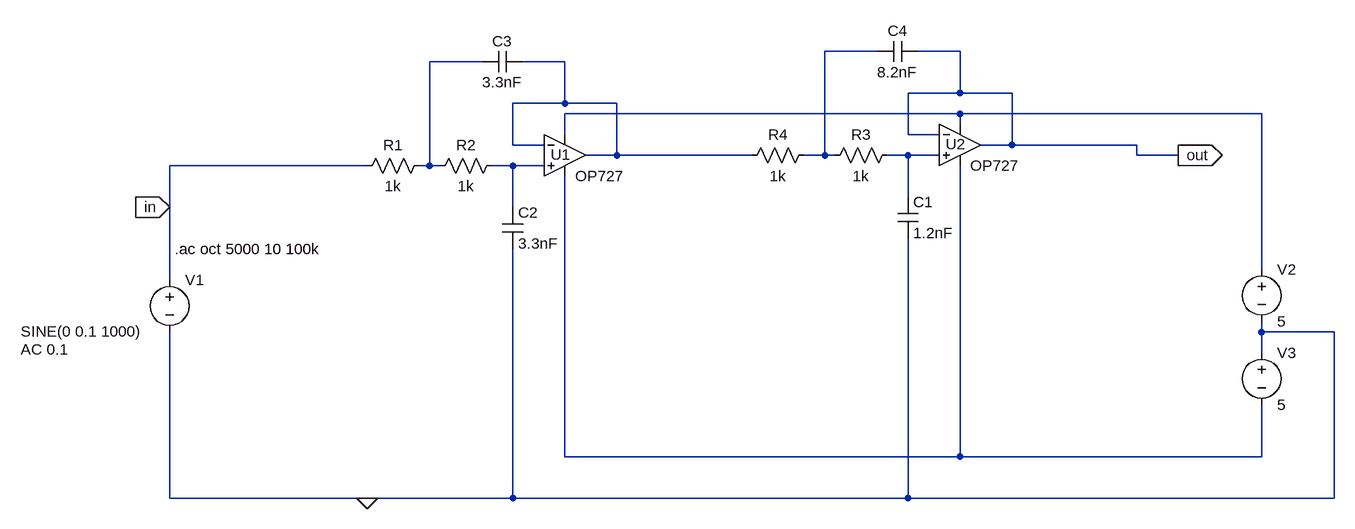
[diagram p0: schematic Butterworth_Active_50kHz.asc]
Butterworth_Active_50kHz.asc, the LTspice schematic file:
Version 4.1
SHEET 1 1364 680
WIRE 656 -224 576 -224
WIRE 784 -224 720 -224
WIRE 48 -208 -32 -208
WIRE 176 -208 112 -208
WIRE 784 -160 784 -224
WIRE 784 -160 704 -160
WIRE 864 -160 784 -160
WIRE 176 -144 176 -208
WIRE 176 -144 96 -144
WIRE 256 -144 176 -144
WIRE 784 -128 176 -128
WIRE 1248 -128 784 -128
WIRE 784 -112 784 -128
WIRE 176 -96 176 -128
WIRE 704 -96 704 -160
WIRE 752 -96 704 -96
WIRE 96 -80 96 -144
WIRE 144 -80 96 -80
WIRE 864 -80 864 -160
WIRE 864 -80 816 -80
WIRE 1056 -80 864 -80
WIRE 256 -64 256 -144
WIRE 256 -64 208 -64
WIRE 464 -64 256 -64
WIRE 576 -64 576 -224
WIRE 576 -64 544 -64
WIRE 592 -64 576 -64
WIRE 704 -64 672 -64
WIRE 752 -64 704 -64
WIRE 1056 -64 1056 -80
WIRE 1120 -64 1056 -64
WIRE -128 -48 -432 -48
WIRE -32 -48 -32 -208
WIRE -32 -48 -48 -48
WIRE -16 -48 -32 -48
WIRE 96 -48 64 -48
WIRE 144 -48 96 -48
WIRE 704 0 704 -64
WIRE -432 16 -432 -48
WIRE 96 16 96 -48
WIRE 1248 112 1248 -128
WIRE -432 128 -432 16
WIRE 1248 208 1248 192
WIRE 1360 208 1248 208
WIRE 1248 240 1248 208
WIRE 176 400 176 -32
WIRE 784 400 784 -48
WIRE 784 400 176 400
WIRE 1248 400 1248 320
WIRE 1248 400 784 400
WIRE -432 464 -432 208
WIRE -128 464 -432 464
WIRE 96 464 96 80
WIRE 96 464 -128 464
WIRE 704 464 704 64
WIRE 704 464 96 464
WIRE 1360 464 1360 208
WIRE 1360 464 704 464
FLAG -432 16 in
IOPIN -432 16 In
FLAG 1120 -64 out
IOPIN 1120 -64 Out
FLAG -128 464 0
SYMBOL OpAmps\\OP727 176 -128 R0
WINDOW 0 -22 63 Left 2
SYMATTR InstName U1
SYMBOL voltage -432 112 R0
WINDOW 3 -229 95 Left 2
WINDOW 123 -229 123 Left 2
WINDOW 39 0 0 Left 0
SYMATTR InstName V1
SYMATTR Value SINE(0 0.1 1000)
SYMATTR Value2 AC 0.1
SYMBOL res -32 -64 R90
WINDOW 0 0 56 VBottom 2
WINDOW 3 32 56 VTop 2
SYMATTR InstName R1
SYMATTR Value 1k
SYMBOL res 80 -64 R90
WINDOW 0 0 56 VBottom 2
WINDOW 3 32 56 VTop 2
SYMATTR InstName R2
SYMATTR Value 1k
SYMBOL cap 80 16 R0
SYMATTR InstName C2
SYMATTR Value 3.3nF
SYMBOL voltage 1248 96 R0
SYMATTR InstName V2
SYMATTR Value 5
SYMBOL voltage 1248 224 R0
WINDOW 123 0 0 Left 0
WINDOW 39 0 0 Left 0
SYMATTR InstName V3
SYMATTR Value 5
SYMBOL cap 112 -224 R90
WINDOW 0 0 32 VBottom 2
WINDOW 3 32 32 VTop 2
SYMATTR InstName C3
SYMATTR Value 3.3nF
SYMBOL OpAmps\\OP727 784 -144 R0
WINDOW 0 -22 63 Left 2
SYMATTR InstName U2
SYMBOL res 688 -80 R90
WINDOW 0 0 56 VBottom 2
WINDOW 3 32 56 VTop 2
SYMATTR InstName R3
SYMATTR Value 1k
SYMBOL cap 688 0 R0
SYMATTR InstName C1
SYMATTR Value 1.2nF
SYMBOL cap 720 -240 R90
WINDOW 0 0 32 VBottom 2
WINDOW 3 32 32 VTop 2
SYMATTR InstName C4
SYMATTR Value 8.2nF
SYMBOL res 560 -80 R90
WINDOW 0 0 56 VBottom 2
WINDOW 3 32 56 VTop 2
SYMATTR InstName R4
SYMATTR Value 1k
TEXT -424 80 Left 2 !.ac oct 5000 10 100k

The netlist it stands for:
* Butterworth_Active_50kHz.asc
X§U1 N006 N003 N004 N007 N003 OP727  ; pins In+ In- V+ V- OUT
V1 in 0 SINE(0 0.1 1000) AC 0.1
R1 N002 in 1k
R2 N006 N002 1k
C2 N006 0 3.3nF
V2 N004 0 5
V3 0 N007 5
C3 N003 N002 3.3nF
X§U2 N005 out N004 N007 out OP727  ; pins In+ In- V+ V- OUT
R3 N005 N001 1k
C1 N005 0 1.2nF
C4 out N001 8.2nF
R4 N001 N003 1k
.ac oct 5000 10 100k
.backanno
.end